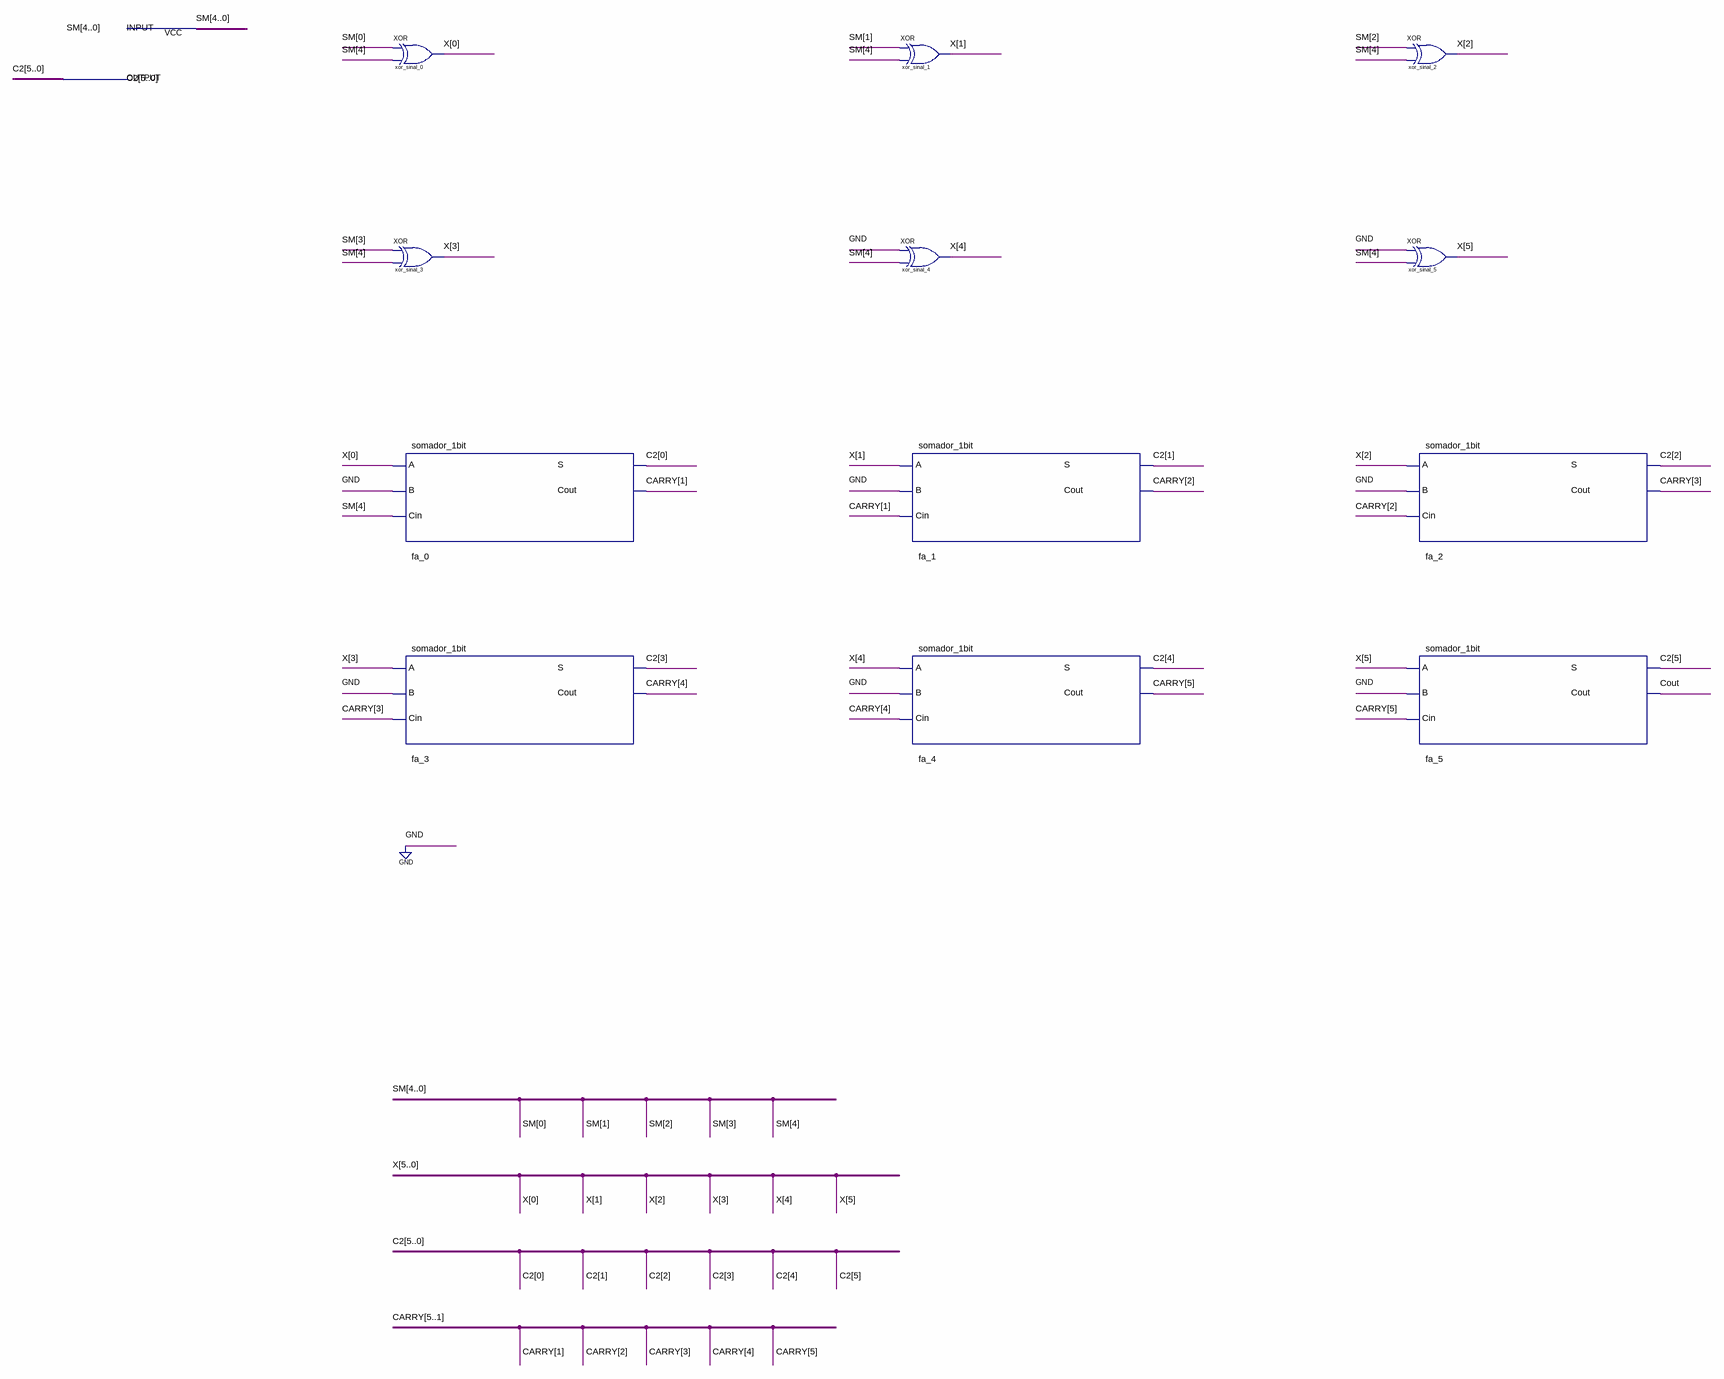
[diagram p0: schematic sheet]
// Quartus schematic sm_para_c2.bdf as structural Verilog: 12 symbols, 2 pins
module sm_para_c2 (
  input  [4:0] SM,
  output [5:0] C2
);

  wire Cout;
  wire [5:0] X;
  wire [5:1] CARRY;

  xor xor_sinal_0 (X[0], SM[0], SM[4]);
  xor xor_sinal_3 (X[3], SM[3], SM[4]);
  somador_1bit fa_0 (.A(X[0]), .B(1'b0), .Cin(SM[4]), .S(C2[0]), .Cout(CARRY[1]));
  somador_1bit fa_3 (.A(X[3]), .B(1'b0), .Cin(CARRY[3]), .S(C2[3]), .Cout(CARRY[4]));
  xor xor_sinal_1 (X[1], SM[1], SM[4]);
  xor xor_sinal_4 (X[4], 1'b0, SM[4]);
  somador_1bit fa_1 (.A(X[1]), .B(1'b0), .Cin(CARRY[1]), .S(C2[1]), .Cout(CARRY[2]));
  somador_1bit fa_4 (.A(X[4]), .B(1'b0), .Cin(CARRY[4]), .S(C2[4]), .Cout(CARRY[5]));
  xor xor_sinal_2 (X[2], SM[2], SM[4]);
  xor xor_sinal_5 (X[5], 1'b0, SM[4]);
  somador_1bit fa_2 (.A(X[2]), .B(1'b0), .Cin(CARRY[2]), .S(C2[2]), .Cout(CARRY[3]));
  somador_1bit fa_5 (.A(X[5]), .B(1'b0), .Cin(CARRY[5]), .S(C2[5]), .Cout(Cout));
endmodule
